# Altium project Lora_Count.PrjPcb
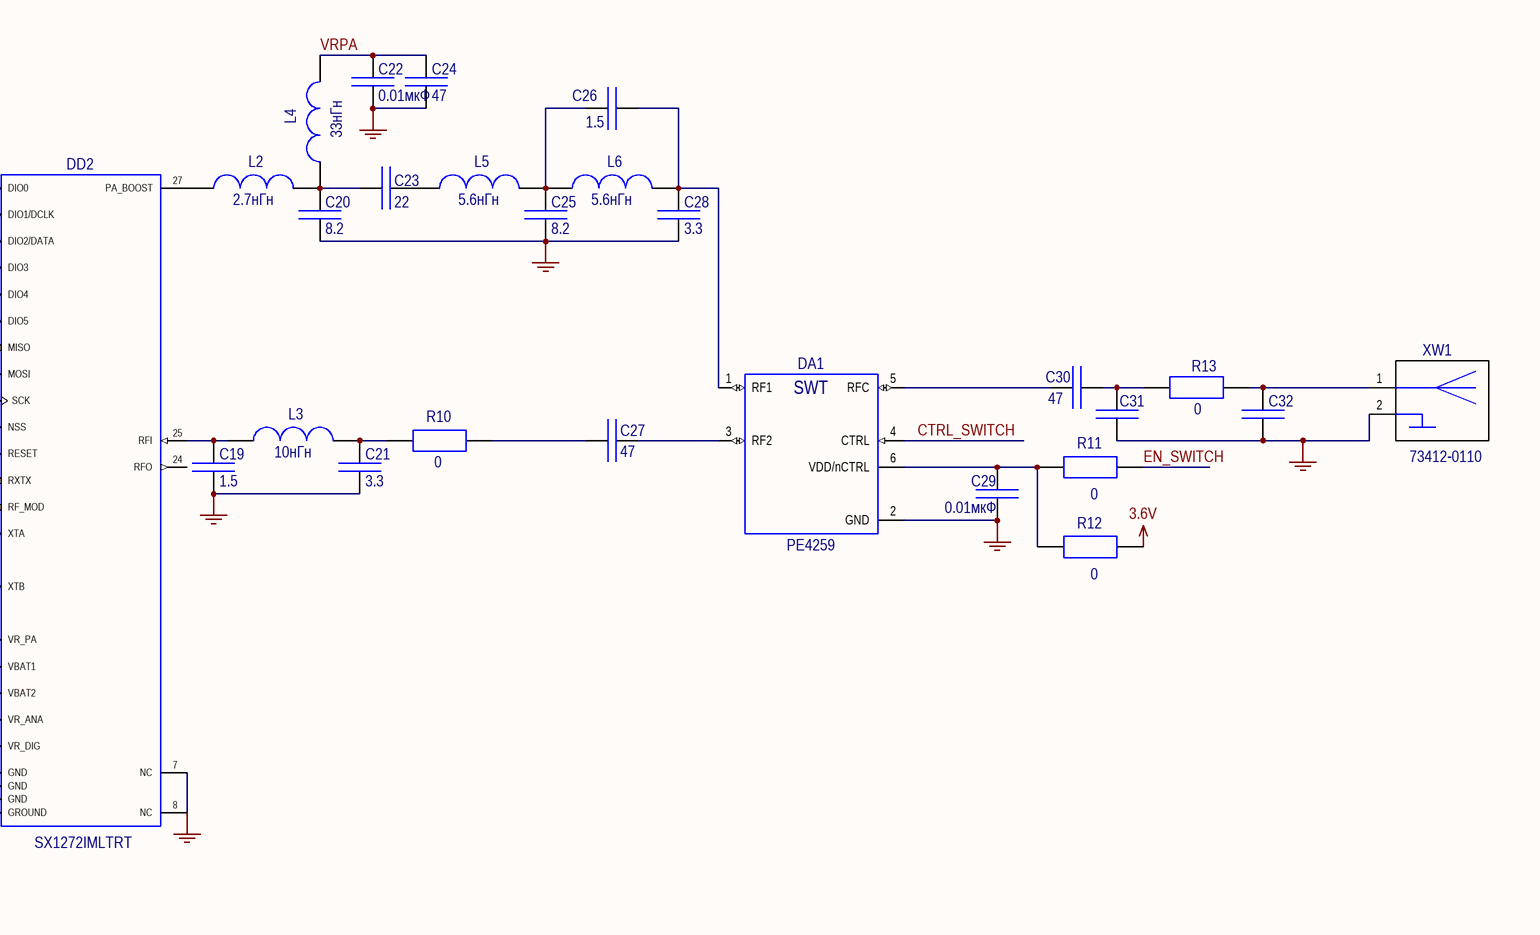
[diagram p0: Lora_Count.SchDoc, top right]
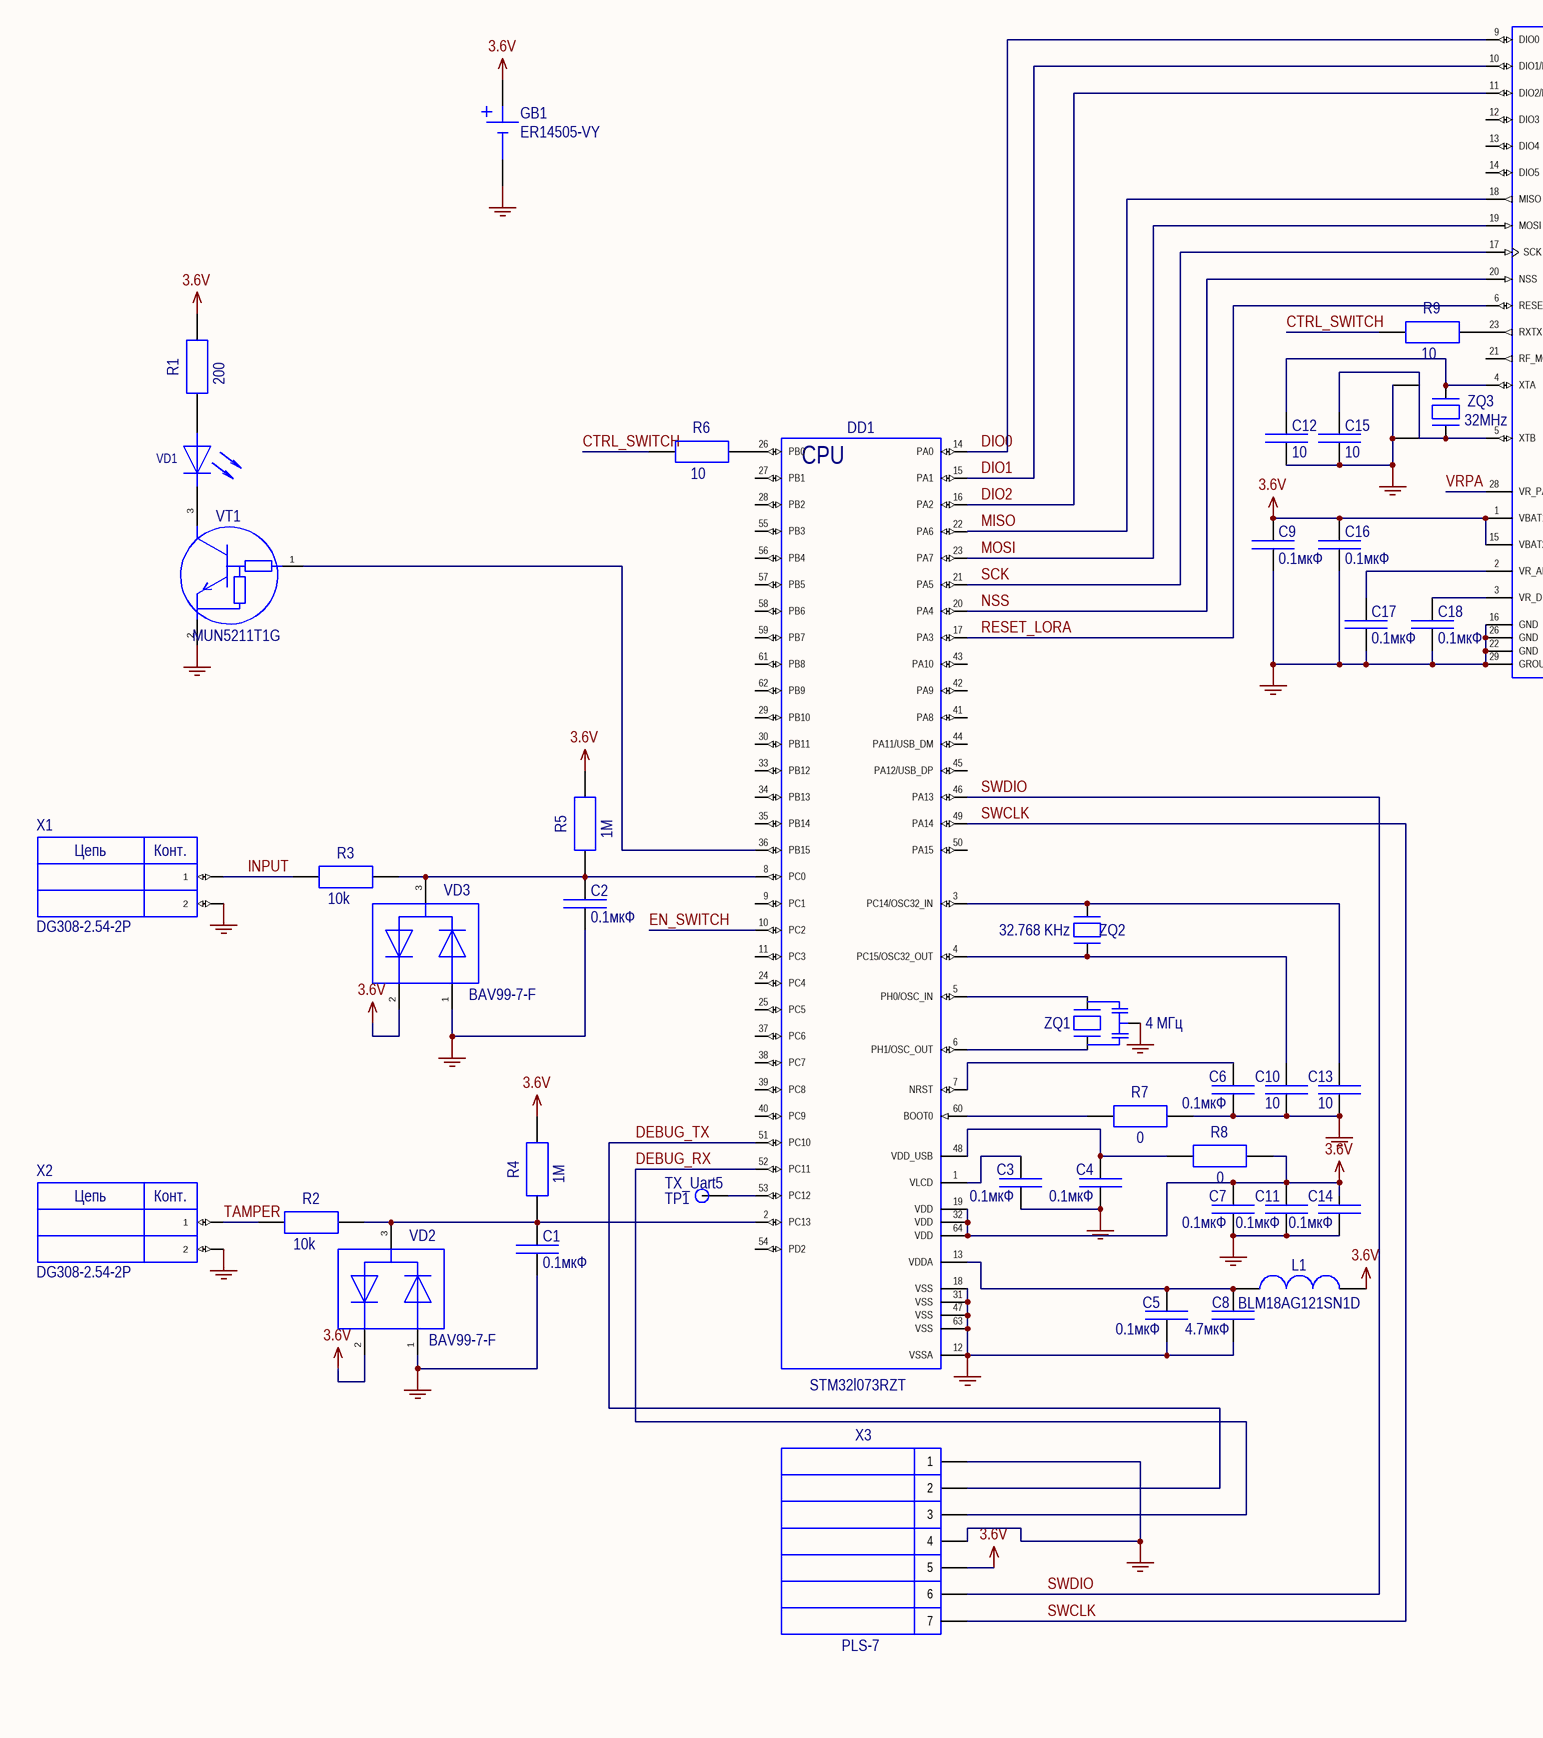
[diagram p1: Lora_Count.SchDoc, bottom left]
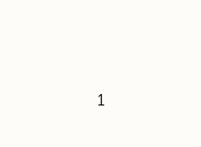
[diagram p2: Lora_Count.SchDoc, bottom right]
1 sheet, 67 parts. Net scope: global (net labels, ports and power ports of the same name join across sheets).
Board file: Lora_Count.PcbDoc

## Sheet Lora_Count.SchDoc
size 594 x 420 mm; CheckedBy: Трухачев И.; Author: Денисов В.; SheetNumber: 1; PageSetup: Record=PageOptions|CenterHorizontal=True|CenterVertical=True|PrintScale=0.94|XCorrection=1.00|YCorrection=1.00|PrintKind=1|BorderSize=5000000|LeftOffset=0|BottomOffset=0|Orientation=1|PaperLength=1000|PaperWidth=1000|Scale=100|PaperSource=7|PrintQuality=-4|MediaType=1|DitherType=10|PaperKind=A4|PrintScaleMode=1; DecimalNumber: ГРКЕ.464421.033 Э3; HeadOfSector: Нач. сектора; MainDevice: Перв.примен.; Name: Изделие-счетчик

### Parts
C1  value 0.1мкФ  [CAPC1005X50(0402)]  (hidden comment: чип 0402 0.1мкФ/10V,)
C2  value 0.1мкФ  [CAPC1005X50(0402)]  (hidden comment: чип 0402 0.1мкФ/10V,)
C3  value 0.1мкФ  [CAPC1005X50(0402)]  (hidden comment: чип 0402 0.1мкФ/10V,)
C4  value 0.1мкФ  [CAPC1005X50(0402)]  (hidden comment: чип 0402 0.1мкФ/10V,)
C5  value 0.1мкФ  [CAPC1005X50(0402)]  (hidden comment: чип 0402 0.1мкФ/10V,)
C6  value 0.1мкФ  [CAPC1005X50(0402)]  (hidden comment: чип 0402 0.1мкФ/10V,)
C7  value 0.1мкФ  [CAPC1005X50(0402)]  (hidden comment: чип 0402 0.1мкФ/10V,)
C8  value 4.7мкФ  [CAPC1608X50(0603)]  (hidden comment: чип 0603 4.7мкФ/50V,)
C9  value 0.1мкФ  [CAPC1005X50(0402)]  (hidden comment: чип 0402 0.1мкФ/10V,)
C10  value 10  [CAPC1005X50(0402)]  (hidden comment: чип 0402 10/10V,)
C11  value 0.1мкФ  [CAPC1005X50(0402)]  (hidden comment: чип 0402 0.1мкФ/10V,)
C12  value 10  [CAPC1005X50(0402)]  (hidden comment: чип 0402 10/10V,)
C13  value 10  [CAPC1005X50(0402)]  (hidden comment: чип 0402 10/10V,)
C14  value 0.1мкФ  [CAPC1005X50(0402)]  (hidden comment: чип 0402 0.1мкФ/10V,)
C15  value 10  [CAPC1005X50(0402)]  (hidden comment: чип 0402 10/10V,)
C16  value 0.1мкФ  [CAPC1005X50(0402)]  (hidden comment: чип 0402 0.1мкФ/10V,)
C17  value 0.1мкФ  [CAPC1005X50(0402)]  (hidden comment: чип 0402 0.1мкФ/10V,)
C18  value 0.1мкФ  [CAPC1005X50(0402)]  (hidden comment: чип 0402 0.1мкФ/10V,)
C19  value 1.5  [CAPC1005X50(0402)]  (hidden comment: чип 0402 1.5/10V,)
C20  value 8.2  [CAPC1005X50(0402)]  (hidden comment: чип 0402 8.2/10V,)
C21  value 3.3  [CAPC1005X50(0402)]  (hidden comment: чип 0402 3.3/10V,)
C22  value 0.01мкФ  [CAPC1005X50(0402)]  (hidden comment: чип 0402 0.01мкФ/10V,)
C23  value 22  [CAPC1005X50(0402)]  (hidden comment: чип 0402 22/10V,)
C24  value 47  [CAPC1005X50(0402)]  (hidden comment: чип 0402 47/10V,)
C25  value 8.2  [CAPC1005X50(0402)]  (hidden comment: чип 0402 8.2/10V,)
C26  value 1.5  [CAPC1005X50(0402)]  (hidden comment: чип 0402 1.5/10V,)
C27  value 47  [CAPC1005X50(0402)]  (hidden comment: чип 0402 47/10V,)
C28  value 3.3  [CAPC1005X50(0402)]  (hidden comment: чип 0402 3.3/10V,)
C29  value 0.01мкФ  [CAPC1005X50(0402)]  (hidden comment: чип 0402 0.01мкФ/10V,)
C30  value 47  [CAPC1005X50(0402)]  (hidden comment: чип 0402 47/10V,)
C31  чип 0402 NC/10V,  [CAPC1005X50(0402)]  (value not drawn)
C32  чип 0402 NC/10V,  [CAPC1005X50(0402)]  (value not drawn)
DA1  PE4259  [SOT65P210X110-6N(SOT363)]
DD1  STM32l073RZT  [TSQFP50P1200X1200X160-64N]
DD2  SX1272IMLTRT  [QFN65P600X600X100_HS-29N]
GB1  ER14505-VY  [ER14505-VY]
L1  BLM18AG121SN1D  [RESC1608X45(0603)]
L2  2.7нГн  [RESC1005X35(0402)]
L3  10нГн  [RESC1005X35(0402)]
L4  33нГн  [RESC1005X35(0402)]
L5  5.6нГн  [RESC1005X35(0402)]
L6  5.6нГн  [RESC1005X35(0402)]
R1  value 200  [RESC1005X35(0402)]  (hidden comment: чип 0402 200 5%)
R2  value 10k  [RESC1005X35(0402)]  (hidden comment: чип 0402 10k 5%)
R3  value 10k  [RESC1005X35(0402)]  (hidden comment: чип 0402 10k 5%)
R4  value 1M  [RESC1005X35(0402)]  (hidden comment: чип 0402 1M 5%)
R5  value 1M  [RESC1005X35(0402)]  (hidden comment: чип 0402 1M 5%)
R6  value 10  [RESC1005X35(0402)]  (hidden comment: чип 0402 10 5%)
R7  value 0  [RESC1005X35(0402)]  (hidden comment: чип 0402 0 5%)
R8  value 0  [RESC1005X35(0402)]  (hidden comment: чип 0402 0 5%)
R9  value 10  [RESC1005X35(0402)]  (hidden comment: чип 0402 10 5%)
R10  value 0  [RESC1005X35(0402)]  (hidden comment: чип 0402 0 5%)
R11  value 0  [RESC1005X35(0402)]  (hidden comment: чип 0402 0 5%)
R12  value 0  [RESC1005X35(0402)]  (hidden comment: чип 0402 0 5%)
R13  value 0  [RESC1005X35(0402)]  (hidden comment: чип 0402 0 5%)
TP1  TX_Uart5  [TEST_POINT]  (no BOM)
VD1  чип 0603 LED (RED)  [LEDC1608X80N(0603)_red]  (value not drawn)
VD2  BAV99-7-F  [SOT95P230-3N(SOT23)_NUM]
VD3  BAV99-7-F  [SOT95P230-3N(SOT23)_NUM]
VT1  MUN5211T1G  [SOT65P200X110-3N (SOT323)_NUM]
X1  DG308-2.54-2P  [DG308-2.54-2P]
X2  DG308-2.54-2P  [DG308-2.54-2P]
X3  PLS-7  [HEADER1-7P2.54]
XW1  73412-0110  [73412-0110]
ZQ1  value 4 МГц  [XTAL320X130X120 (CSTCE_G15C)]  (hidden comment: CSTCE8M00G52A-R0(4 МГц))
ZQ2  value 32.768 KHz  [XTAL320X150X90-2N(DST)]  (hidden comment: DST310S(32.768 KHz))
ZQ3  value 32MHz  [XTAL320X250X78-4N(ADM8)]  (hidden comment: KX-7T-12.88662 12MHz(32MHz))

### Nets
3.6V: C7.2(P2) C9.2(P2) C11.2(P2) C14.2(P2) C16.2(P2) DD1.19(VDD) DD1.32(VDD) DD1.64(VDD) DD2.1(VBAT1) DD2.15(VBAT2) GB1.1 L1.1 R1.1 R4.1 R5.1 R8.1 R12.2 VD2.2 VD3.2 X3.5
GND: C1.1(P1) C2.1(P1) C3.1(P1) C4.1(P1) C5.1(P1) C6.1(P1) C7.1(P1) C8.1 C9.1(P1) C10.1(P1) C11.1(P1) C12.1(P1) C13.1(P1) C14.1(P1) C15.1(P1) C16.1(P1) C17.1(P1) C18.1(P1) C19.1(P1) C20.1(P1) C21.1(P1) C22.1(P1) C24.1(P1) C25.1(P1) C28.1(P1) C29.2(P2) C31.2(P2) C32.2(P2) DA1.2(GND) DD1.12(VSSA) DD1.18(VSS) DD1.31(VSS) DD1.47(VSS) DD1.63(VSS) DD2.7(NC) DD2.8(NC) DD2.16(GND) DD2.22(GND) DD2.26(GND) DD2.29(GROUND) GB1.2 R7.1 VD2.1 VD3.1 VT1.2(E) X1.2 X2.2 X3.1 X3.4 XW1.2(GND) ZQ1.2 ZQ3.2 ZQ3.4
CTRL_SWITCH: DA1.4(CTRL) R6.2 R9.2
DEBUG_RX: DD1.52(PC11) X3.3
DEBUG_TX: DD1.51(PC10) X3.2
DIO0: DD1.14(PA0) DD2.9(DIO0)
DIO1: DD1.15(PA1) DD2.10(DIO1/DCLK)
DIO2: DD1.16(PA2) DD2.11(DIO2/DATA)
EN_SWITCH: DD1.10(PC2) R11.2
INPUT: R3.2 X1.1
MISO: DD1.22(PA6) DD2.18(MISO)
MOSI: DD1.23(PA7) DD2.19(MOSI)
NSS: DD1.20(PA4) DD2.20(NSS)
RESET_LORA: DD1.17(PA3) DD2.6(RESET)
SCK: DD1.21(PA5) DD2.17(SCK)
SWCLK: DD1.49(PA14) X3.7
SWDIO: DD1.46(PA13) X3.6
TAMPER: R2.2 X2.1
VRPA: C22.2(P2) C24.2(P2) DD2.28(VR_PA) L4.2
NetC1_2: C1.2(P2) DD1.2(PC13) R2.1 R4.2 VD2.3
NetC2_2: C2.2(P2) DD1.8(PC0) R3.1 R5.2 VD3.3
NetC3_2: C3.2(P2) DD1.1(VLCD)
NetC4_2: C4.2(P2) DD1.48(VDD_USB) R8.2
NetC5_2: C5.2(P2) C8.2 DD1.13(VDDA) L1.2
NetC6_2: C6.2(P2) DD1.7(NRST)
NetC10_2: C10.2(P2) DD1.4(PC15/OSC32_OUT) ZQ2.1
NetC12_2: C12.2(P2) DD2.4(XTA) ZQ3.1
NetC13_2: C13.2(P2) DD1.3(PC14/OSC32_IN) ZQ2.2
NetC15_2: C15.2(P2) DD2.5(XTB) ZQ3.3
NetC17_2: C17.2(P2) DD2.2(VR_ANA)
NetC18_2: C18.2(P2) DD2.3(VR_DIG)
NetC19_2: C19.2(P2) DD2.25(RFI) L3.1
NetC20_2: C20.2(P2) C23.2(P2) L2.2 L4.1
NetC21_2: C21.2(P2) L3.2 R10.1
NetC23_1: C23.1(P1) L5.1
NetC25_2: C25.2(P2) C26.2(P2) L5.2 L6.1
NetC26_1: C26.1(P1) C28.2(P2) DA1.1(RF1) L6.2
NetC27_1: C27.1(P1) DA1.3(RF2)
NetC27_2: C27.2(P2) R10.2
NetC29_1: C29.1(P1) DA1.6(VDD/nCTRL) R11.1 R12.1
NetC30_1: C30.1(P1) C31.1(P1) R13.1
NetC30_2: C30.2(P2) DA1.5(RFC)
NetC32_1: C32.1(P1) R13.2 XW1.1
NetDD1_5: DD1.5(PH0/OSC_IN) ZQ1.1
NetDD1_6: DD1.6(PH1/OSC_OUT) ZQ1.3
NetDD1_26: DD1.26(PB0) R6.1
NetDD1_36: DD1.36(PB15) VT1.1(B)
NetDD1_53: DD1.53(PC12) TP1.1
NetDD1_60: DD1.60(BOOT0) R7.2
NetDD2_23: DD2.23(RXTX) R9.1
NetDD2_27: DD2.27(PA_BOOST) L2.1
NetR1_2: R1.2 VD1.A(anod)
NetVD1_C: VD1.C(cathode) VT1.3(C)

Not connected (* = marked no-connect by the designer): DD1 9(PC1) 11(PC3) 24(PC4) 25(PC5) 27(PB1) 28(PB2) 29(PB10) 30(PB11) 33(PB12) 34(PB13) 35(PB14) 37(PC6) 38(PC7) 39(PC8) 40(PC9) 41(PA8) 42(PA9) 43(PA10) 44(PA11/USB_DM) 45(PA12/USB_DP) 50(PA15) 54(PD2) 55(PB3) 56(PB4) 57(PB5) 58(PB6) 59(PB7) 61(PB8) 62(PB9); DD2 12(DIO3) 13(DIO4) 14(DIO5) 21(RF_MOD) 24(RFO)

### Notes on the sheet
- 1
- Перв.примен.
- Справ.№
- Подп. и дата
- Инв.№ дубл.
- Взам.инв.№
- Подп.и дата
- Разраб.
- Изм.
- Лист
- № докум.
- Подп.
- Дата
- Лит.
- Масса
- Масштаб
- Т.контр.
- Пров.
- СХЕМА   ЭЛЕКТРИЧЕСКАЯ
- ПРИНЦИПИАЛЬНАЯ
- Листов
- Инв.№ подл.
- Утв.
- Н.контр.
- Нач.сект.
- Формат  A2
- (in symbol DG308-2.54-2P) Цепь; Конт.
- (in symbol PE4259) SWT
- (in symbol STM32l073RZT) CPU

### Library data of the parts
C1 C2 C4-C7 C9 C14 C16-C18 = C0402: cmpDescription: чип 0402 0.1мкФ , 10V, ,; parVoltage: 10V; Category: Конденсатор; cmpPkg: чип 0402
C3 C11 = C0402: cmpPartNum: CC0402KRX7R8BB104; cmpDescription: чип 0402 0.1мкФ , 10V, , CC0402KRX7R8BB104; parVoltage: 10V; Category: Конденсатор; cmpPkg: чип 0402
C8 = C0603: cmpPartNum: GRM188R60J475KE19D; cmpDescription: чип 0603 4.7мкФ , 50V, , GRM188R60J475KE19D; parVoltage: 50V; Category: Конденсатор; cmpPkg: чип 0603
C10 C12 C13 C15 = C0402: cmpDescription: чип 0402 10 , 10V, ,; parVoltage: 10V; Category: Конденсатор; cmpPkg: чип 0402
C19 C26 = C0402: cmpPartNum: NONE; cmpDescription: чип 0402 1.5 , 10V, , NONE; parVoltage: 10V; Category: Конденсатор; cmpPkg: чип 0402
C20 C25 = C0402: cmpPartNum: GRM1555C1H8R2CZ01D; cmpDescription: чип 0402 8.2 , 10V, , GRM1555C1H8R2CZ01D; parVoltage: 10V; Category: Конденсатор; cmpPkg: чип 0402
C21 C28 = C0402: cmpPartNum: GRM1555C1H3R3CZ01D; cmpDescription: чип 0402 3.3 , 10V, , GRM1555C1H3R3CZ01D; parVoltage: 10V; Category: Конденсатор; cmpPkg: чип 0402
C22 = C0402: cmpPartNum: GRM155R71E103KA01D; cmpDescription: чип 0402 0.01мкФ , 10V, , GRM155R71E103KA01D; parVoltage: 10V; Category: Конденсатор; cmpPkg: чип 0402
C23 = C0402: cmpPartNum: GRM1555C1H220JZ01D; cmpDescription: чип 0402 22 , 10V, , GRM1555C1H220JZ01D; parVoltage: 10V; Category: Конденсатор; cmpPkg: чип 0402
C24 C27 C30 = C0402: cmpPartNum: GRM1555C1H470JZ01D; cmpDescription: чип 0402 47 , 10V, , GRM1555C1H470JZ01D; parVoltage: 10V; Category: Конденсатор; cmpPkg: чип 0402
C29 = C0402: cmpPartNum: GRM155R71H102JA01D; cmpDescription: чип 0402 0.01мкФ , 10V, , GRM155R71H102JA01D; parVoltage: 10V; Category: Конденсатор; cmpPkg: чип 0402
C31 C32 = C0402: cmpDescription: чип 0402 NC , 10V, ,; parVoltage: 10V; Value: NC; Category: Конденсатор; cmpPkg: чип 0402
DA1 = PE4259: SOT363 RF Switch IC General Purpose SPDT 50 Ohm; cmpManufacturer: Peregrine; cmpPkg: SOT-363; parBandwidth: 3 GHz; cmpDescription: Peregrine PE4259 (SOT-363); cmpPartNum: PE4259; Category: Микросхема
DD1 = STM32l073RZT: LQFP-64 Ultra-low-power 32-bit MCU ARM®-based Cortex®-M0+, up to 192KB  Flash, 20KB SRAM, 6KB EEPROM, LCD, USB, ADC, DACs; cmpManufacturer: ST; parOTemp: -40°C to 85°C; cmpDescription: ST STM32l073RZT (LQFP-64); Value: *; Category: Микросхема; cmpPkg: LQFP-64; cmpPartNum: STM32l073RZT
DD2 = SX1272IMLTRT: SX1272/73 - 860 MHz to 1020 MHz Low Power Long Range Transceiver; cmpManufacturer: Semtech; cmpPkg: QFN-28; parOTemp: -40°C to 85°C; cmpDescription: Semtech SX1272IMLTRT (QFN-28); Category: Микросхема; cmpPartNum: SX1272IMLTRT
L1 = L0603: Chip coil 0603; cmpDescription: , чип 0603 BLM18AG121SN1D , ,; cmpPkg: чип 0603; Category: Дроссель; Value: BLM18AG121SN1D
L2 = L0402: Chip coil 0402; cmpPartNum: LQW15AN2N7D00D; cmpDescription: LQW15AN2N7D00D, чип 0402 2.7нГн , ,; cmpPkg: чип 0402; Category: Дроссель; Value: 2.7нГн
L3 = L0402: Chip coil 0402; cmpPartNum: LQG15HS10NJ02D; cmpDescription: LQG15HS10NJ02D, чип 0402 10нГн , ,; cmpPkg: чип 0402; Category: Дроссель; Value: 10нГн
L4 = L0402: Chip coil 0402; cmpPartNum: LQW15AN33NJ00D; cmpDescription: LQW15AN33NJ00D, чип 0402 33нГн , ,; cmpPkg: чип 0402; Category: Дроссель; Value: 33нГн
L5 L6 = L0402: Chip coil 0402; cmpPartNum: LQW15AN5N6C10D; cmpDescription: LQW15AN5N6C10D, чип 0402 5.6нГн , ,; cmpPkg: чип 0402; Category: Дроссель; Value: 5.6нГн
R1 = R0402: cmpDescription: чип 0402 200 5%, 62 мВт, ,; parPwr: 62 мВт; Category: Резистор; cmpPkg: чип 0402; Tolerance: 5%
R2 R3 = R0402: cmpDescription: чип 0402 10k 5%, 62 мВт, ,; parPwr: 62 мВт; Category: Резистор; cmpPkg: чип 0402; Tolerance: 5%
R4 R5 = R0402: cmpDescription: чип 0402 1M 5%, 62 мВт, ,; parPwr: 62 мВт; Category: Резистор; cmpPkg: чип 0402; Tolerance: 5%
R6 R9 = R0402: cmpDescription: чип 0402 10 5%, 62 мВт, ,; parPwr: 62 мВт; Category: Резистор; cmpPkg: чип 0402; Tolerance: 5%
R7 R8 = R0402: cmpDescription: чип 0402 0 5%, 62 мВт, ,; parPwr: 62 мВт; Category: Резистор; cmpPkg: чип 0402; Tolerance: 5%
R10-R13 = R0402: cmpPartNum: CRCW04020000Z0ED; cmpDescription: чип 0402 0 5%, 62 мВт, , CRCW04020000Z0ED; parPwr: 62 мВт; Category: Резистор; cmpPkg: чип 0402; Tolerance: 5%
TP1 = TEST_POINT: cmpCategory: Industrial; Value: TX_Uart5; Category: Тестпойнт
VD1 = LED 0603: cmpDescription: LED 0603, LED RED, чип 0603; parLvTyp: xxмкд; parPd: ххмВт; parVf: хВ; Примечание: *; Category: Диод; cmpPkg: чип 0603; cmpPartNum: LED 0603; parColor: RED; cmpType: LED
VD2 VD3 = BAV99: cmpManufacturer: Diodes inc.; cmpPkg: SOT-23; cmpType: General DS; cmpDescription: BAV99-7-F, General DS 0.2А 75В, SOT-23; parOTemp: -65°C to +150°C; parCap: 2пФ; parIf: 0.2А; parPd: 225мВт; parVdc: 75В; parIpk: 1А; parVf: 1.25В; parIr: 2.5мкА; Category: Диод; cmpPartNum: BAV99-7-F
VT1 = MUN5211T1G: MUN5211T1; cmpManufacturer: ON Semiconductor; Title: Транзистор; cmpPkg: SOT-323; parHfe: 35-60; parOTemp: -55°C to 150°C; parCurrent: 0.1А; parVce: 50В; cmpType: NPN General; parR1value: 10К; Category: Транзистор; cmpPartNum: MUN5211T1G; cmpDescription: =cmpPartNum+' '+cmpType+' '+parType+' '+cmpPkg; parR2value: 10К
X3 = PLS-7: Pin Header Single Row 7 pins; cmpCategory: Industrial; cmpDescription: pitch, pins,; Value: *; Category: Разъем
XW1 = 73412-0110: Micro coaxial connector receptacle vertical; cmpManufacturer: Molex; cmpCategory: Industrial; parOtemp: -40°C to 90°C; cmpPkg: SMD; parZ: 50 Ом; cmpDescription: Molex 73412-0110, SMD Vertical, 50 Ом, -40°C to 90°C; Category: Разъем; cmpPartNum: 73412-0110; parType: Vertical
ZQ1 = XTAL, SMD, 3.2mm x 1.3mm, 3 pads: CSTCE_G CERALOCK Ceramic Resonators; cmpManufacturer: Murata; cmpPkg: SMD, 3.2x1.3 mm; Tolerance: ±0.5%; parCl: BuiltIN cap; cmpDescription: Murata CSTCE8M00G52A-R0, (4 МГц±0.5%), BuiltIN cap; parOTemp: -40°C to 125°C; cmpPinCount: 3; Category: Кварцевый Резонатор; cmpPartNum: CSTCE8M00G52A-R0
ZQ2 = XTAL, SMD, 3.2mm x 1.5mm, 2 pads: DST310S; cmpManufacturer: Daishinku Corporation; cmpPkg: SMD, 3.2x1.5 mm; parOTemp: -40°C to 85°C; cmpDescription: Кварцевый Резонатор Daishinku Corporation DST310S, (32.768 KHz), 9pF, SMD, 3.2x1.5 mm,  pads, -40°C to 85°C; parCload: 9pF; Category: Кварцевый Резонатор; cmpPartNum: DST310S
ZQ3 = XTAL, SMD, 3.2mm x 2.5mm, 4 pads: KX-7T series; cmpManufacturer: Geyer; cmpDescription: Geyer KX-7T-12.88662 12MHz, (32MHz±100 ppm), 12pF; cmpPkg: SMD, 3.2x2.5 mm; parOTemp: -40°C to 85°C; Tolerance: ±100 ppm; parCl: 12pF; Category: Кварцевый Резонатор; cmpPartNum: KX-7T-12.88662 12MHz